# EAGLE design otto 1284 K (EAGLE 6.1)
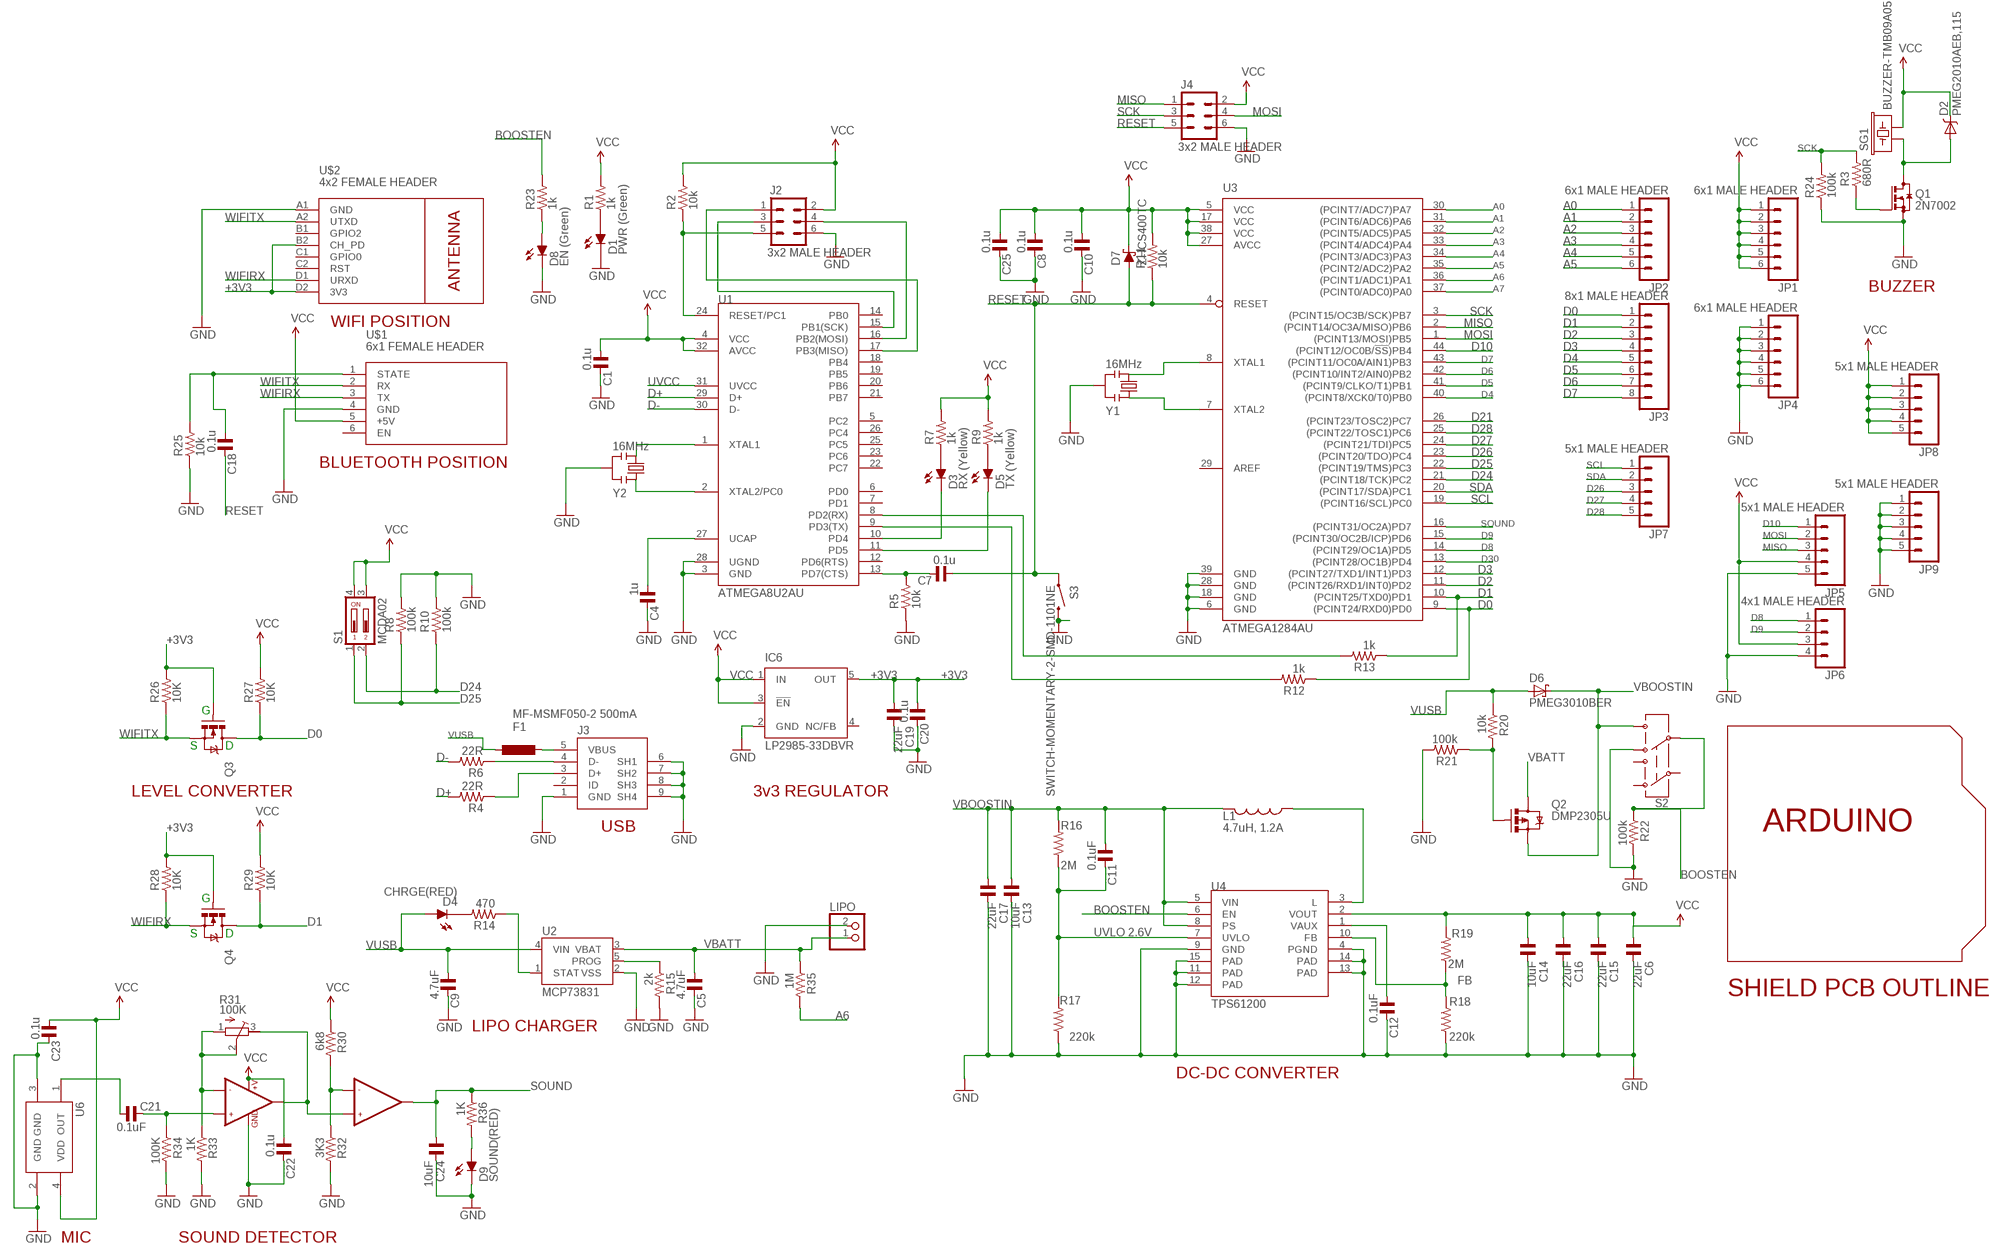
[diagram p0: schematic, sheet 1]

## Parts
C1  0.1u  C_0805MP  [C0805MP]
C4  1u  C_0805MP  [C0805MP]
C5  4.7uF  C_0603MP  [C0603MP]
C6  22uF  C_0805MP  [C0805MP]
C7  0.1u  C_0805MP  [C0805MP]
C8  0.1u  C_0805MP  [C0805MP]
C9  4.7uF  C_0603MP  [C0603MP]
C10  0.1u  C_0805MP  [C0805MP]
C11  0.1uF  C_0603MP  [C0603MP]
C12  0.1uF  C_0603MP  [C0603MP]
C13  10uF  C_1206MP  [C1206MP]
C14  10uF  C_1206MP  [C1206MP]
C15  22uF  C_0805MP  [C0805MP]
C16  22uF  C_0805MP  [C0805MP]
C17  22uF  C_0805MP  [C0805MP]
C18  0.1u  C_0805MP  [C0805MP]
C19  22uF  C_0805MP  [C0805MP]
C20  0.1u  C_0805MP  [C0805MP]
C21  0.1uF  C_0603MP  [C0603MP]
C22  0.1u  C_0603MP  [C0603MP]
C23  0.1u  C_0603MP  [C0603MP]
C24  10uF  C_1206MP  [C1206MP]
C25  0.1u  C_0603MP  [C0603MP]
D1  PWR (Green)  LEDCHIP-LED0805MP  [CHIP-LED0805MP]
D2  PMEG2010AEB,115  DIODE-SCHOTTKY  [SOD-523]
D3  RX (Yellow)  LEDCHIP-LED0805MP  [CHIP-LED0805MP]
D4  CHRGE(RED)  LEDCHIP-LED0805MP  [CHIP-LED0805MP]
D5  TX (Yellow)  LEDCHIP-LED0805MP  [CHIP-LED0805MP]
D6  PMEG3010BER  [SOD123W]
D7  ZHCS400TC  SCHOTTKY-DIODESOD323  [SOD323]
D8  EN (Green)  LEDCHIP-LED0805MP  [CHIP-LED0805MP]
D9  SOUND(RED)  LEDCHIP-LED0805MP  [CHIP-LED0805MP]
F1  MF-MSMF050-2 500mA  0002_MF-MSMF050-2  [L1812]
IC6  LP2985-33DBVR  TPS77033  [SOT23-DBV]
J2  3x2 MALE HEADER  M03X2-LOCK  [2X03_LOCK]
J3  0219_14850  [USB-MINI-B_2]
J4  3x2 MALE HEADER  M03X2-LOCK  [2X03_LOCK]
JP1  6x1 MALE HEADER  M06SIP  [1X06]
JP2  6x1 MALE HEADER  M06SIP  [1X06]
JP3  8x1 MALE HEADER  M081X08  [1X08]
JP4  6x1 MALE HEADER  M06SIP  [1X06]
JP5  5x1 MALE HEADER  M05PTH  [1X05]
JP6  4x1 MALE HEADER  M04PTH  [1X04]
JP7  5x1 MALE HEADER  M05PTH  [1X05]
JP8  5x1 MALE HEADER  M05PTH  [1X05]
JP9  5x1 MALE HEADER  M05PTH  [1X05]
L1  4.7uH, 1.2A  INDUCTOR-CDRH4D16FB  [INDUCTOR-CDRH4D16FB]
LIPO  JST_2PIN-THM  [JST-PH-2-THM]
Q1  2N7002  BSS123  [SOT23]
Q2  DMP2305U  MOSFET-PCHANNELSMD  [SOT23-3]
Q3  2N7002  MOSFET-NCHANNELBSS123LT1G  [SOT23]
Q4  2N7002  MOSFET-NCHANNELBSS123LT1G  [SOT23]
R1  1k  R_0805MP  [R0805MP]
R2  10k  R_0805MP  [R0805MP]
R3  680R  R_0805MP  [R0805MP]
R4  22R  R_0805MP  [R0805MP]
R5  10k  R_0805MP  [R0805MP]
R6  22R  R_0805MP  [R0805MP]
R7  1k  R_0805MP  [R0805MP]
R8  100k  R_0805MP  [R0805MP]
R9  1k  R_0805MP  [R0805MP]
R10  100k  R_0805MP  [R0805MP]
R11  10k  R_0805MP  [R0805MP]
R12  1k  R_0805MP  [R0805MP]
R13  1k  R_0805MP  [R0805MP]
R14  470  R_0603MP  [R0603MP]
R15  2k  R_0603MP  [R0603MP]
R16  2M  R_0603MP  [R0603MP]
R17  220k  R_0603MP  [R0603MP]
R18  220k  R_0603MP  [R0603MP]
R19  2M  R_0603MP  [R0603MP]
R20  10k  R_0805MP  [R0805MP]
R21  100k  R_0805MP  [R0805MP]
R22  100k  R_0603MP  [R0603MP]
R23  1k  R_0805MP  [R0805MP]
R24  100k  R_0805MP  [R0805MP]
R25  10k  R_0805MP  [R0805MP]
R26  10K  R_0603MP  [R0603MP]
R27  10K  R_0603MP  [R0603MP]
R28  10K  R_0603MP  [R0603MP]
R29  10K  R_0603MP  [R0603MP]
R30  6k8  R_0603MP  [R0603MP]
R31  100K  R-TRIMM4G/J  [RTRIM4G/J]
R32  3K3  R_0603MP  [R0603MP]
R33  1K  R_0603MP  [R0603MP]
R34  100K  R_0603MP  [R0603MP]
R35  1M  R_0603MP  [R0603MP]
R36  1K  R_0603MP  [R0603MP]
S1  MCDA02  DA02  [DA-02]
S2  SWITCH-DPDTEG2211  [EG2211]
S3  SWITCH-MOMENTARY-2-SMD-1101NE  [TACTILE-SWITCH-1101NE]
SG1  BUZZER-TMB09A05  BUZZER-CPE-171  [BUZZER_9MM_PTH]
U1  ATMEGA8U2AU  [TQFP32-08]
U2  MCP73831  [SOT23-5]
U3  ATMEGA1284AU  ATMEGA1284P-AU  [TQFP44]
U4  TPS61200  [QFN-10_PAD]
U5  LMV358  [SO08]
U6  SPW2430_MIC  [SPW2430_SILICON_MIC]
U$1  6x1 FEMALE HEADER  WIRELESS-BLUETOOTH-HC-05-PLAIN  [WIRELESS-BLUETOOTH-HC-05-PLAIN]
U$2  4x2 FEMALE HEADER  WIRELESS-WIFI-ESP-01-PLAIN  [WIRELESS-WIFI-ESP-01-PLAIN]
U$47  SHIELDSMALL  [ARDUINOSHIELDSMALL]
Y1  16MHz  0011_CSTCE16M0V53-R0  [RESONATOR]
Y2  16MHz  0011_CSTCE16M0V53-R0  [RESONATOR]

## Nets
+3V3: C19.1 C20.1 IC6.5(OUT) Q3.1(G) Q4.1(G) R26.2 R28.2 U$2.B2(CH_PD) U$2.D2(3V3)
A0: JP2.1 U3.30((PCINT7/ADC7)PA7)
A1: JP2.2 U3.31((PCINT6/ADC6)PA6)
A2: JP2.3 U3.32((PCINT5/ADC5)PA5)
A3: JP2.4 U3.33((PCINT4/ADC4)PA4)
A4: JP2.5 U3.34((PCINT3/ADC3)PA3)
A5: JP2.6 U3.35((PCINT2/ADC2)PA2)
A6: R35.2 U3.36((PCINT1/ADC1)PA1)
A7: U3.37((PCINT0/ADC0)PA0)
BOOSTEN: R22.1 R23.2 S2.P2 U4.6(EN)
D0: JP3.1 Q3.3(D) R12.1 R27.1 U3.9((PCINT24/RXD0)PD0)
D1: JP3.2 Q4.3(D) R13.1 R29.1 U3.10((PCINT25/TXD0)PD1)
D2: JP3.3 U3.11((PCINT26/RXD1/INT0)PD2)
D3: JP3.4 U3.12((PCINT27/TXD1/INT1)PD3)
D4: JP3.5 U3.40((PCINT8/XCK0/T0)PB0)
D5: JP3.6 U3.41((PCINT9/CLKO/T1)PB1)
D6: JP3.7 U3.42((PCINT10/INT2/AIN0)PB2)
D7: JP3.8 U3.43((PCINT11/OC0A/AIN1)PB3)
D8: JP6.1 U3.14((PCINT29/OC1A)PD5)
D9: JP6.2 U3.15((PCINT30/OC2B/ICP)PD6)
D10: JP5.1 U3.44((PCINT12/OC0B/!SS!)PB4)
D21: U3.26((PCINT23/TOSC2)PC7)
D24: R10.1 S1.2 U3.21((PCINT18/TCK)PC2)
D25: R8.1 S1.1 U3.22((PCINT19/TMS)PC3)
D26: JP7.3 U3.23((PCINT20/TDO)PC4)
D27: JP7.4 U3.24((PCINT21/TDI)PC5)
D28: JP7.5 U3.25((PCINT22/TOSC1)PC6)
D30: U3.13((PCINT28/OC1B)PD4)
D+: R4.2 U1.29(D+)
D-: R6.2 U1.30(D-)
FB: R18.2 R19.1 U4.10(FB)
GND: C1.2 C4.2 C5.2 C6.2 C8.2 C9.2 C10.2 C12.2 C13.2 C14.2 C15.2 C16.2 C17.2 C19.2 C20.2 C22.2 C23.2 C24.2 C25.2 D1.C D8.C D9.C IC6.2(GND) J2.6 J3.1(GND) J3.6(SH1) J3.7(SH2) J3.8(SH3) J3.9(SH4) J4.6 JP4.1 JP4.2 JP4.3 JP4.4 JP4.5 JP4.6 JP5.5 JP6.4 JP9.1 JP9.2 JP9.3 JP9.4 JP9.5 LIPO.2 Q1.2(S) R5.1 R8.2 R10.2 R15.2 R17.1 R18.1 R21.2 R22.2 R24.1 R25.1 R32.2 R33.2 R34.2 S2.P2-TA S3.P$2 U1.3(GND) U1.28(UGND) U2.2(VSS) U3.6(GND) U3.18(GND) U3.28(GND) U3.39(GND) U4.4(PGND) U4.9(GND) U4.11(PAD) U4.12(PAD) U4.13(PAD) U4.14(PAD) U4.15(PAD) U5.4(GND) U6.2(GND) U6.3(GND) U$1.4(GND) U$2.A1(GND) Y1.2 Y2.2
MISO: J4.1 JP5.3 U3.2((PCINT14/OC3A/MISO)PB6)
MOSI: J4.4 JP5.2 U3.1((PCINT13/MOSI)PB5)
N$1: U3.8(XTAL1) Y1.3
N$2: U3.7(XTAL2) Y1.1
N$3: R15.1 U2.5(PROG)
N$4: D2.A Q1.3(D) SG1.P$1
N$5: Q1.1(G) R3.1
N$6: R12.2 U1.9(PD3(TX))
N$7: R13.2 U1.8(PD2(RX))
N$8: U1.1(XTAL1) Y2.3
N$9: U1.2(XTAL2/PC0) Y2.1
N$10: C4.1 U1.27(UCAP)
N$11: J3.3(D+) R4.1
N$12: J3.4(D-) R6.1
N$13: J2.1 U1.17(PB3(MISO))
N$14: J2.3 U1.15(PB1(SCK))
N$15: J2.5 R2.1 U1.24(RESET/PC1)
N$16: J2.4 U1.16(PB2(MOSI))
N$17: F1.2 J3.5(VBUS)
N$18: R14.1 U2.1(STAT)
N$19: D4.C R14.2
N$20: L1.P$1 U4.3(L)
N$21: C12.1 U4.1(VAUX)
N$22: D8.A R23.1
N$23: C18.1 R25.2 U$1.1(STATE)
N$24: Q2.1(G) R20.2 R21.1
N$25: R31.1(A) R31.2(S) R33.1 U5.2(-IN1)
N$26: D3.A R7.1
N$27: D5.A R9.1
N$28: R31.3(E) U5.1(OUT1) U5.5(+IN2)
N$29: D3.C U1.10(PD4)
N$30: D5.C U1.11(PD5)
N$31: C7.2 R5.2 U1.13(PD7(CTS))
N$32: R30.2 R32.1 U5.6(-IN2)
N$33: C21.2 R34.1 U5.3(+IN1)
N$34: D1.A R1.1
N$35: C21.1 U6.1(OUT)
N$37: D9.A R36.2
RESET: C7.1 C18.2 D7.A J4.5 R11.1 S3.P$1 U3.4(RESET)
SCK: J4.3 R3.2 R24.2 U3.3((PCINT15/OC3B/SCK)PB7)
SCL: JP7.1 U3.19((PCINT16/SCL)PC0)
SDA: JP7.2 U3.20((PCINT17/SDA)PC1)
SOUND: C24.1 R36.1 U3.16((PCINT31/OC2A)PD7) U5.7(OUT2)
UVCC: U1.31(UVCC)
UVLO: C11.2 R16.1 R17.2 U4.7(UVLO)
VBATT: C5.1 LIPO.1 Q2.3(D) R35.1 U2.3(VBAT)
VBOOSTIN: C11.1 C13.1 C17.1 D6.1(K) L1.P$2 Q2.2(S) R16.2 S2.P2-TB U4.5(VIN) U4.8(PS)
VCC: C1.1 C6.1 C8.1 C10.1 C14.1 C15.1 C16.1 C22.1 C23.1 C25.1 D2.C D7.C IC6.1(IN) IC6.3(!EN) J2.2 J4.2 JP1.1 JP1.2 JP1.3 JP1.4 JP1.5 JP1.6 JP5.4 JP6.3 JP8.1 JP8.2 JP8.3 JP8.4 JP8.5 R1.2 R2.2 R7.2 R9.2 R11.2 R19.2 R27.2 R29.2 R30.1 S1.3 S1.4 SG1.P$2 U1.4(VCC) U1.32(AVCC) U3.5(VCC) U3.17(VCC) U3.27(AVCC) U3.38(VCC) U4.2(VOUT) U5.8(+V) U6.4(VDD) U$1.5(+5V)
VUSB: C9.1 D4.A D6.2(A) F1.1 R20.1 U2.4(VIN)
WIFIRX: Q4.2(S) R28.1 U$1.3(TX) U$2.D1(URXD)
WIFITX: Q3.2(S) R26.1 U$1.2(RX) U$2.A2(UTXD)
Unconnected: IC6.4(NC/FB) J3.2(ID) S2.P1 S2.P1-TA S2.P1-TB U1.5(PC2) U1.6(PD0) U1.7(PD1) U1.12(PD6(RTS)) U1.14(PB0) U1.18(PB4) U1.19(PB5) U1.20(PB6) U1.21(PB7) U1.22(PC7) U1.23(PC6) U1.25(PC5) U1.26(PC4) U3.29(AREF) U$1.6(EN) U$2.B1(GPIO2) U$2.C1(GPIO0) U$2.C2(RST)

## Notes on the sheet
- BUZZER
- WIFI POSITION
- BLUETOOTH POSITION
- G
- S | D
- LEVEL CONVERTER | 3v3 REGULATOR
- USB
- G
- S | D | UVLO 2.6V
- SHIELD PCB OUTLINE
- LIPO CHARGER
- DC-DC CONVERTER
- MIC | SOUND DETECTOR

## Library data of the parts
C1 C4-C25 = rc-master-smd:C_: NON-POLARIZED CAP
D1 D3-D5 D8 D9 = led:LED: LED Various Types
D2 = SparkFun-DiscreteSemi:DIODE-SCHOTTKY: Commonly MBRA140.
D6 = nxp_60_1_1:PMEG3010: 30 V, 1A low VF MEGA Schottky barrier rectifier Planar Maximum Efficiency General Application (MEGA) Schottky barrier rectifier with an integrated guard ring for stress protection, encapsulated in a Surface-Mounted Device (SMD) AAL Eindhoven MK
D7 = diode:SCHOTTKY-DIODE: Schottky Diode
F1 = Protezione:0002_MF-MSMF050-2: 500 mA Multifuse � Polyfuse; MONTHLY_USAGE: _____; PART_NUMBER: MF-MSMF050-2; PRICE: _____; SUPPLIER: _____; TYPE: Protezione
IC6 = texas:TPS770*: ULTRALOW-POWER 50-mA LOW-DROPOUT LINEAR REGULATORS 50-mA Low-Dropout Regulator Source: http://focus.ti.com/lit/ds/symlink/tps77001.pdf
J2 J4 = adi-misc:M03X2: This is a 3x2 pin header Note: This part is based on the Sparkfun M04X2 header.
J3 = Connettori:0219_14850: Usb-Mini F 90 Smd; MONTHLY_USAGE: _____; PART_NUMBER: 14850; PRICE: _____; SUPPLIER: _____; TYPE: Connettori; VALUE: USB-mini-90 -SMD
JP1 JP4 = SparkFun-Connectors:M06: Header 6 Standard 6-pin 0.1" header. Use with straight break away headers (SKU : PRT-00116), right angle break away headers (PRT-00553), swiss pins (PRT-00743), machine pins (PRT-00117), and female headers (PRT-00115). Molex polarized connector foot print use with SKU : PRT-08094 with associated ...
JP2 = SparkFun:M06: Header 6 Standard 6-pin 0.1" header. Use with straight break away headers (SKU : PRT-00116), right angle break away headers (PRT-00553), swiss pins (PRT-00743), machine pins (PRT-00117), and female headers (PRT-00115). Molex polarized connector foot print use with SKU : PRT-08094 with associated ...
JP3 = SparkFun:M08: Header 8 Standard 8-pin 0.1" header. Use with straight break away headers (SKU : PRT-00116), right angle break away headers (PRT-00553), swiss pins (PRT-00743), machine pins (PRT-00117), and female headers (PRT-00115).
JP5 JP7-JP9 = SparkFun-Connectors:M05: Header 5 Standard 5-pin 0.1" header. Use with straight break away headers (SKU : PRT-00116), right angle break away headers (PRT-00553), swiss pins (PRT-00743), machine pins (PRT-00117), and female headers (PRT-00115). Molex polarized connector foot print use with SKU : PRT-08230 with associated crimp pins and housings.
JP6 = SparkFun-Connectors:M04: Header 4 Standard 4-pin 0.1" header. Use with straight break away headers (SKU : PRT-00116), right angle break away headers (PRT-00553), swiss pins (PRT-00743), machine pins (PRT-00117), and female headers (PRT-00115). Molex polarized connector foot print use with SKU : PRT-08231 with associated crimp pins and housings. 1MM SMD Version SKU: PRT-10208
L1 = SparkFun-Passives:INDUCTOR-CDRH4D16FB
LIPO = adafruit:JST_2PIN: JST 2-Pin Connectors of various flavors SMT-RA (S2B-PH-SM4) 4UConnector #17311 SMT (B2B-PH-SM4) THM-RA (S2B-PH) THM (B2B-PH)
Q1 = transistor-small-signal:BSS123: N-CHANNEL MOS FET
Q2 = SparkFun-DiscreteSemi:MOSFET-PCHANNEL: Generic PMOSFET
Q3 Q4 = SparkFun-DiscreteSemi:MOSFET-NCHANNEL: Common NMOSFET Parts MFG P/N Store ID Prod ID FDD8780 TRANS-09984 SI7820DN TRANS-11055 FDS6630A IC-08089 2N7002PW TRANS-11151 FQP30N06L COM-10213 TRANS-10060 BSS123LT1G TRANS-08345 BSS138 TRANS-00830 BS170 2N7000; PROD_ID: TRANS-08345
R1-R30 R32-R36 = rc-master-smd:R_: RESISTOR
R31 = rcl:R-TRIMM: Trimm resistor
S1 = switch-dil:DA02: DIL/CODE SWITCH; OC_FARNELL: 1255229; OC_NEWARK: unknown
S2 = SparkFun-Electromechanical:SWITCH-DPDT: DPDT Version of the COM-00597
S3 = SparkFun-Electromechanical:SWITCH-MOMENTARY-2: Various NO switches- pushbuttons, reed, etc
SG1 = bt_buzzer:BUZZER: Buzzer 12mm Spark Fun Electronics SKU : Comp-Buzzer
U1 = SparkFun:ATMEGA8U2: Atmel 8-bit Microcontroller with 8/16/32K Bystes of ISP Flash and USB Controller. ATmega8U2, ATmega16U2, and ATmega32U2
U2 = SparkFun:MCP73831: Microchip's MCP73831 Miniature single cell, fully integrated Li-Ion, Li-polymer charge management controller http://ww1.microchip.com/downloads/en/DeviceDoc/21984a.pdf
U3 = adi-atmega:ATMEGA1284P: 8-bit Microcontroller with 64K Bytes In-System Programmable Flash Source: http://www.atmel.com/dyn/resources/prod_documents/doc2593.pdf; MPN: ATMEGA644PV-10AU; OC_FARNELL: 1455123; OC_NEWARK: 58M3748
U4 = SparkFun:TPS61200: DC to DC Booster
U5 = SparkFun-AnalogIC:LMV358: Jellybean rail-to-rail output op-amp; PROD_ID: IC-09657
U6 = Tristan:SPW2430_MIC: Top Port SiSonic Silicon Microphone with input buffer and output amp Technical Specifications: Supply voltage range: 1.5V to 3.6V Current draw: 70µA @ VDD = 1.8V, 75µA @ VDD = 3.6V Output impedance: 450Ω (@ 1kHz) Datasheet <http://tristanrobitaille.com/spw2430-datasheet> Digi-Key part #: 423-1394-1-ND <http://www.digikey.ca/product-detail/en/knowles/SPW2430HR5H-B/423-1394-1-ND/5052772> Mouser part #: 721-SPW2430HR5HB <http://ca.mouser.com/ProductDetail/Knowles/SPW2430HR5H-B/?qs=%2fha2pyFaduhwHrXlkuR8qD3oDzxHBwOI5SNV724NzP3WuccUjWgX3w%3d%3d> Manufacturer part #: SPW2430HR5H-B; DIGIKEY#: 423-1394-1-ND; MANF: SPW2430HR5H-B SMD Microphone; MANF#: SPW2430HR5H-B; MOUSER#: 721-SPW2430HR5HB
U$1 = diy-modules:WIRELESS-BLUETOOTH-HC-05-PLAIN
U$2 = diy-modules:WIRELESS-WIFI-ESP-01-PLAIN
U$47 = adafruit:SHIELDSMALL
Y1 Y2 = Cristalli:0011_CSTCE16M0V53-R0: 16Mhz - SMD; MONTHLY_USAGE: _____; PART_NUMBER: CSTCE16M0V53-R0; PRICE: _____; SUPPLIER: _____; TYPE: Cristalli; VALUE: CSTCE16M0V53-R0

## Net classes
1 24vPower: width 1.016 mm, clearance 0.762 mm
2 5vPower: width 0.813 mm, clearance 0.762 mm

## Board
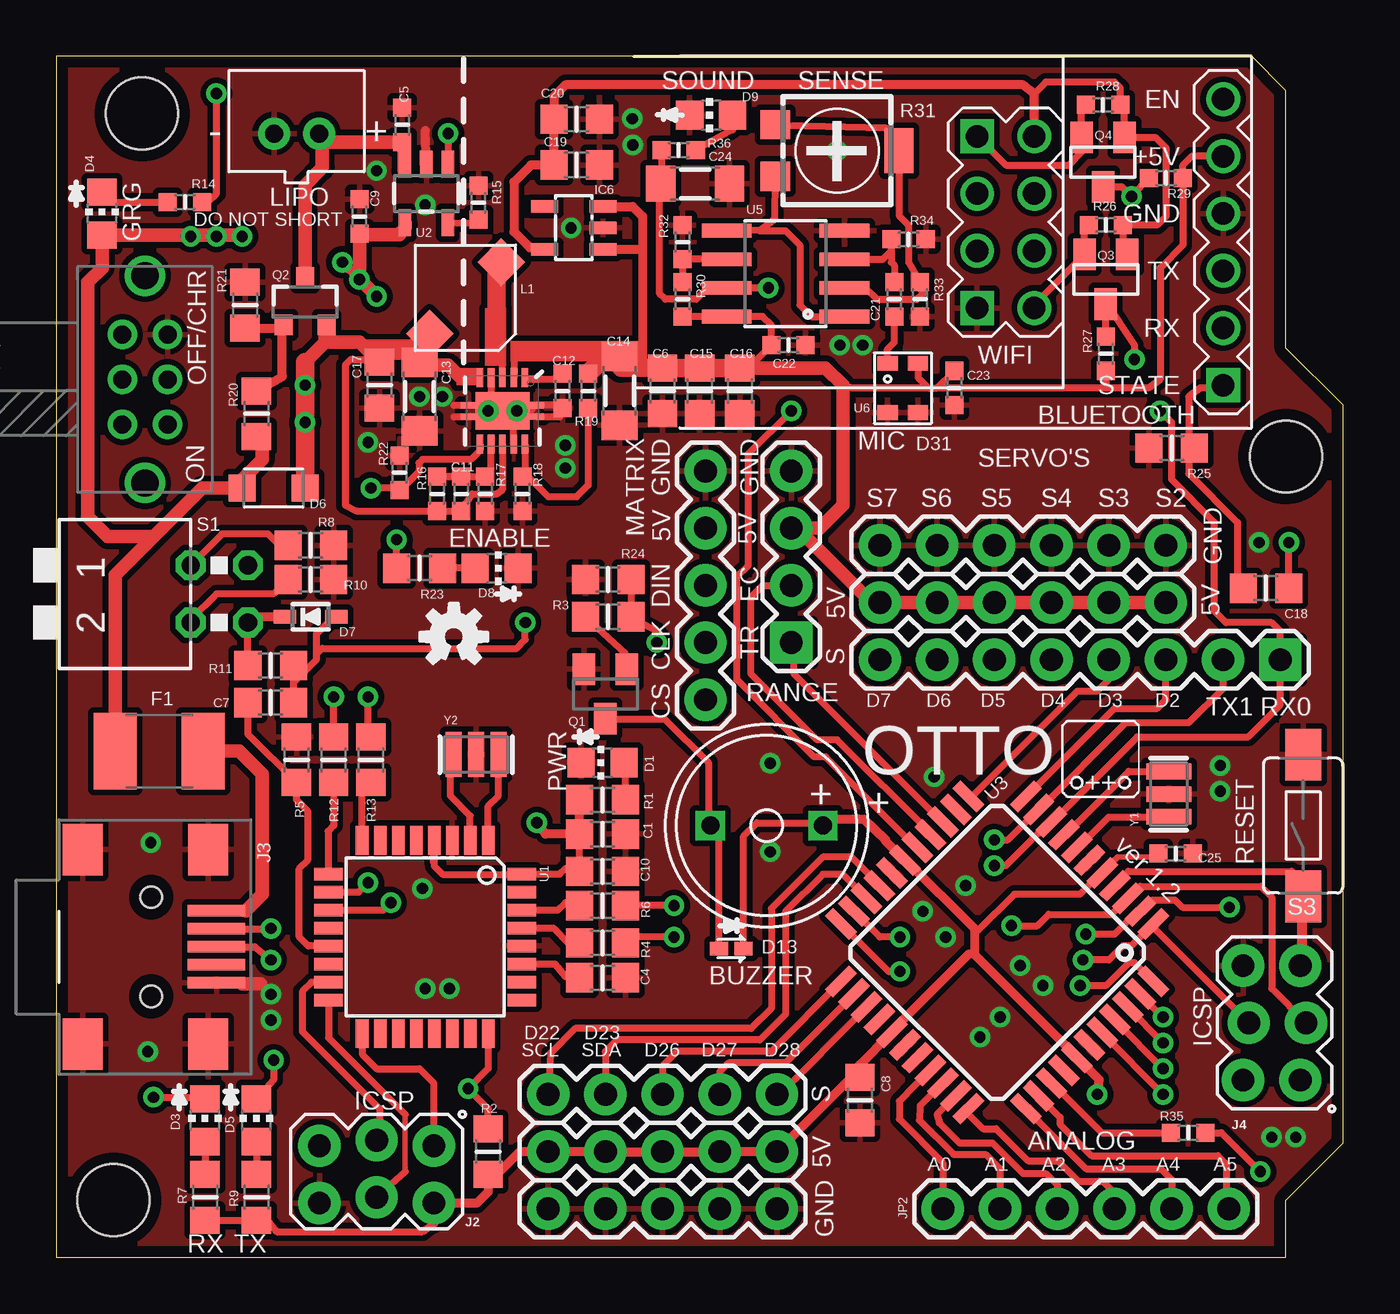
[diagram p1: board, top side]
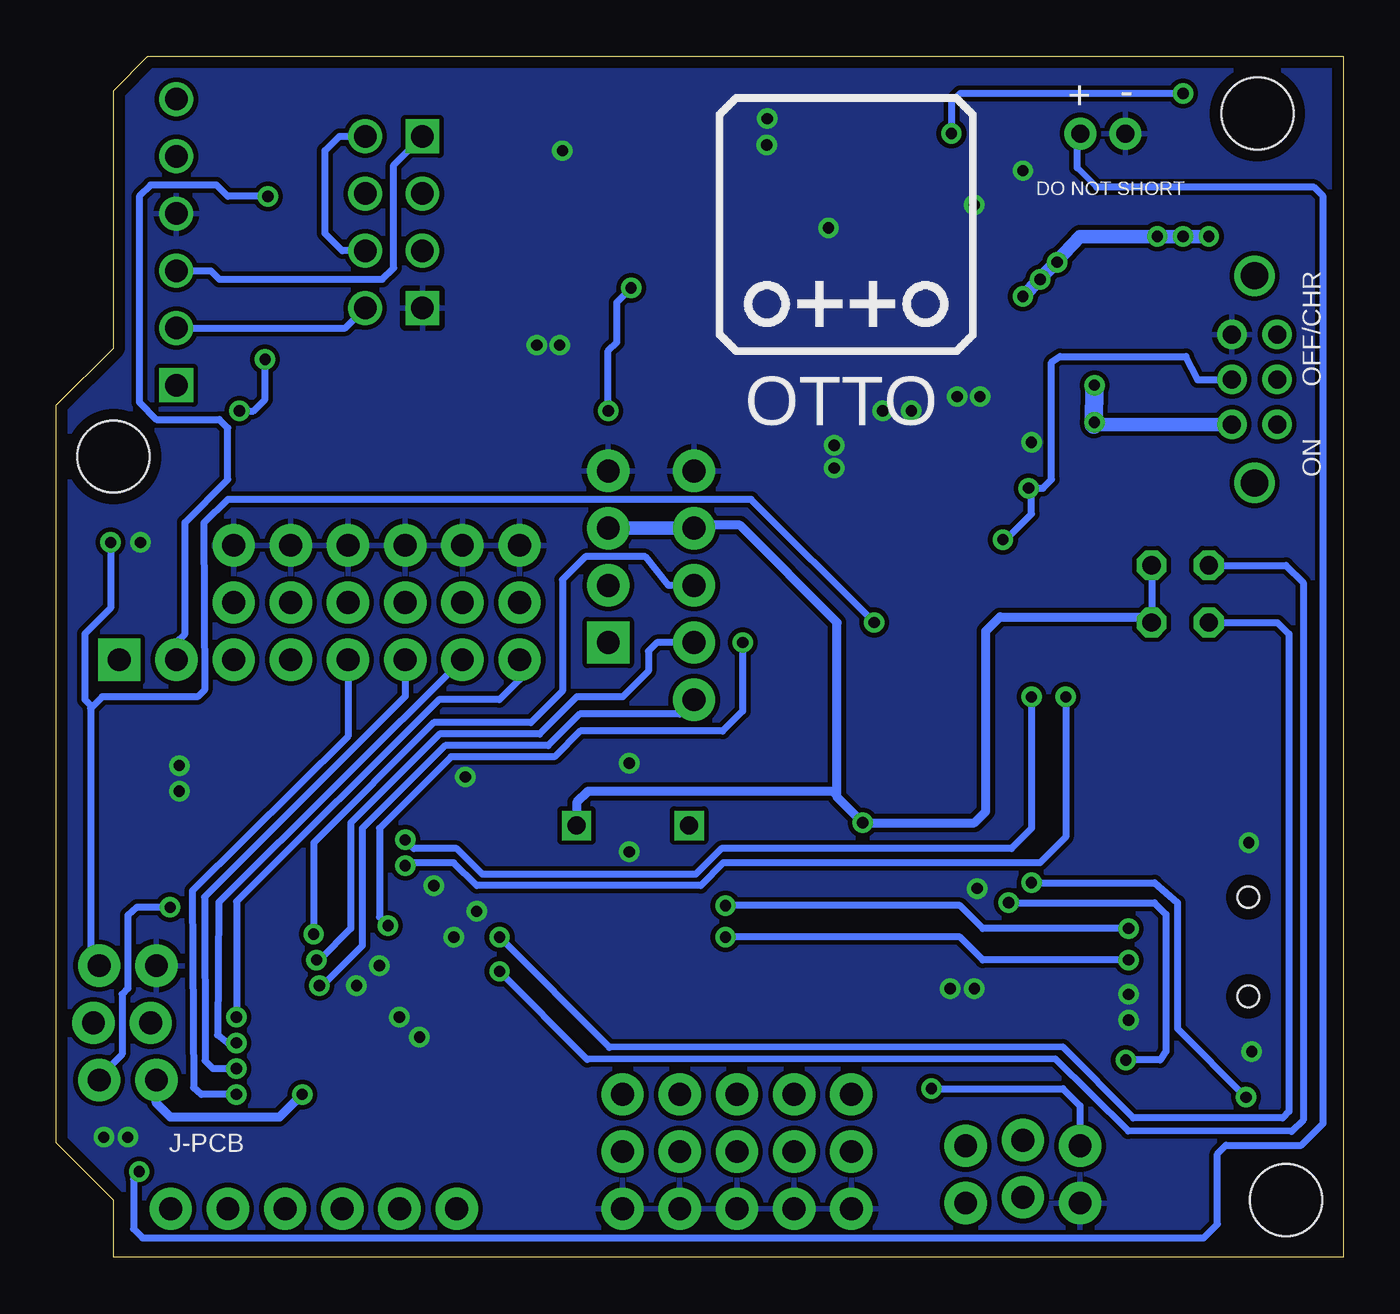
[diagram p2: board, bottom side, seen from below]

Size 57.15 x 53.34 mm. Coordinates in mm from the lower left corner, seen from the top.
Copper layers (1*16): Top 0.035mm / dielectric 1.5mm / Bottom 0.035mm
Design rules: minimum track width 10mil, minimum drill 24mil, track to track 8mil, track to pad 8mil, pad to pad 8mil, via to via 8mil, smd to smd 8mil, copper to edge 20mil, drill to drill 8mil, minimum pad ring 10mil, minimum via ring 8mil, stop-mask expansion 4mil, vias tented up to drill 25mil, thermal gap 10mil

### Footprints (pad centres in the part's own frame; a part is rotated, then mirrored left to right if it is on the bottom)
C0805MP = smd 1.2 x 1.3: 1 -1.016,0; 2 1.016,0
C0603MP = smd 0.8 x 0.8: 1 -0.762,0; 2 0.762,0
C1206MP = smd 1.3 x 1.6: 1 -1.524,0; 2 1.524,0
CHIP-LED0805MP = smd 1.3 x 1.2: A 0,-0.953; C 0,0.953
SOD-523 = smd 0.8 x 0.6: A -0.55,0; C 0.55,0
SOD123W = smd 1.2 x 1.2: 1 -1.4,0; 2 1.4,0
SOD323 = smd 1 x 0.6: A 1.143,0; C -1.143,0
L1812 = smd 1.9 x 3.4: 1 -1.95,0; 2 1.95,0
SOT23-DBV = smd 0.55 x 1.2: 1 -0.95,-1.3; 2 0,-1.3; 3 0.95,-1.3; 4 0.95,1.3; 5 -0.95,1.3
2X03_LOCK = drill 1.016 pad 1.88: 1 -2.54,-1.143; 2 -2.54,1.397; 3 0,-1.397; 4 0,1.143; 5 2.54,-1.143; 6 2.54,1.397
USB-MINI-B_2 = smd 0.508 x 2.54: 1 0,0; 2 0.8,0; 3 1.6,0; 4 2.4,0; 5 3.2,0 | smd 2.286 x 1.778: 6 -2.717,5.948; 7 -2.717,0.36; 8 5.918,0.36; 9 5.918,5.948 | hole 0.95: -0.6,2.9; 3.8,2.9
1X06 = drill 1.016 pad 1.88: 1 0,0; 2 2.54,0; 3 5.08,0; 4 7.62,0; 5 10.16,0; 6 12.7,0
1X08 = drill 1.016 pad 1.88 square: 1 0,0 | drill 1.016 pad 1.88: 2 2.54,0; 3 5.08,0; 4 7.62,0; 5 10.16,0; 6 12.7,0; 7 15.24,0; 8 17.78,0
1X05 = drill 1.016 pad 1.88: 1 0,0; 2 2.54,0; 3 5.08,0; 4 7.62,0; 5 10.16,0
1X04 = drill 1.016 pad 1.88 square: 1 0,0 | drill 1.016 pad 1.88: 2 2.54,0; 3 5.08,0; 4 7.62,0
INDUCTOR-CDRH4D16FB = smd 1.5 x 1.5 rotated 135: P$1 -1.905,1.905 | smd 1.5 x 1.5 rotated 315: P$2 1.27,5.08
JST-PH-2-THM = drill 0.8 pad 1.422: 1 1,0; 2 -1,0
SOT23 = smd 1 x 1.4: 1 -0.95,-1.1; 2 0.95,-1.1; 3 0,1.1
SOT23-3 = smd 0.8 x 0.9: 1 -0.95,-1; 2 0.95,-1; 3 0,1.1
R0805MP = smd 1.2 x 1.3: 1 -1.016,0; 2 1.016,0
R0603MP = smd 0.8 x 0.8: 1 -0.762,0; 2 0.762,0
RTRIM4G/J = smd 1.3 x 1.3: 1 -1.15,-2.75; 3 1.15,-2.75 | smd 2 x 1.3: 2 0,2.75
DA-02 = drill 0.813 octagon: 1 -1.27,-1.27; 2 1.27,-1.27; 3 1.27,1.27; 4 -1.27,1.27
EG2211 = drill 0.8: P1 -1,0; P1-TA -1,2; P1-TB -1,-2; P2 1,0; P2-TA 1,2; P2-TB 1,-2 | drill 1.2: P$7 0,4.6; P$8 0,-4.6
TACTILE-SWITCH-1101NE = smd 2.3 x 1.6: P$1 -3.15,0; P$2 3.15,0
BUZZER_9MM_PTH = drill 0.8 square: P$1 0,2.5; P$2 0,-2.5
TQFP32-08 = smd 1.27 x 0.559: 1 -4.293,2.8; 2 -4.293,2; 3 -4.293,1.2; 4 -4.293,0.4; 5 -4.293,-0.4; 6 -4.293,-1.2; 7 -4.293,-2; 8 -4.293,-2.8; 17 4.293,-2.8; 18 4.293,-2; 19 4.293,-1.2; 20 4.293,-0.4; 21 4.293,0.4; 22 4.293,1.2; 23 4.293,2; 24 4.293,2.8 | smd 0.559 x 1.27: 9 -2.8,-4.293; 10 -2,-4.293; 11 -1.2,-4.293; 12 -0.4,-4.293; 13 0.4,-4.293; 14 1.2,-4.293; 15 2,-4.293; 16 2.8,-4.293; 25 2.8,4.293; 26 2,4.293; 27 1.2,4.293; 28 0.4,4.293; 29 -0.4,4.293; 30 -1.2,4.293; 31 -2,4.293; 32 -2.8,4.293
SOT23-5 = smd 0.55 x 1.2: 1 -0.95,-1.3; 2 0,-1.3; 3 0.95,-1.3; 4 0.95,1.3; 5 -0.95,1.3
TQFP44 = smd 1.5 x 0.5: 1 -5.8,4; 2 -5.8,3.2; 3 -5.8,2.4; 4 -5.8,1.6; 5 -5.8,0.8; 6 -5.8,0; 7 -5.8,-0.8; 8 -5.8,-1.6; 9 -5.8,-2.4; 10 -5.8,-3.2; 11 -5.8,-4; 23 5.8,-4; 24 5.8,-3.2; 25 5.8,-2.4; 26 5.8,-1.6; 27 5.8,-0.8; 28 5.8,0; 29 5.8,0.8; 30 5.8,1.6; 31 5.8,2.4; 32 5.8,3.2; 33 5.8,4 | smd 0.5 x 1.5: 12 -4,-5.8; 13 -3.2,-5.8; 14 -2.4,-5.8; 15 -1.6,-5.8; 16 -0.8,-5.8; 17 0,-5.8; 18 0.8,-5.8; 19 1.6,-5.8; 20 2.4,-5.8; 21 3.2,-5.8; 22 4,-5.8; 34 4,5.8; 35 3.2,5.8; 36 2.4,5.8; 37 1.6,5.8; 38 0.8,5.8; 39 0,5.8; 40 -0.8,5.8; 41 -1.6,5.8; 42 -2.4,5.8; 43 -3.2,5.8; 44 -4,5.8
QFN-10_PAD = smd 0.297 x 0.85: 1 -1,-1.475; 2 -0.5,-1.475; 3 0,-1.475; 4 0.5,-1.475; 5 1,-1.475; 6 1,1.475; 7 0.5,1.475; 8 0,1.475; 9 -0.5,1.475; 10 -1,1.475 | smd 0.7 x 0.28: 11 -1.5,0.25; 12 -1.5,-0.25; 13 1.5,0.25; 14 1.5,-0.25 | smd 2.4 x 1.65: 15 0,0
SO08 = smd 0.61 x 2.21: 1 -1.905,-2.616; 2 -0.635,-2.616; 3 0.635,-2.616; 4 1.905,-2.616; 5 1.905,2.616; 6 0.635,2.616; 7 -0.635,2.616; 8 -1.905,2.616
SPW2430_SILICON_MIC = smd 0.9 x 0.66: 1 -0.675,1.095; 2 -0.675,-1.095; 3 0.675,-1.095; 4 0.675,1.095
WIRELESS-BLUETOOTH-HC-05-PLAIN = drill 1 square: 1 -6.35,-17.145 | drill 1: 2 -3.81,-17.145; 3 -1.27,-17.145; 4 1.27,-17.145; 5 3.81,-17.145; 6 6.35,-17.145
WIRELESS-WIFI-ESP-01-PLAIN = drill 1 square: A1 -7.62,3.81; D1 -7.62,-3.81 | drill 1: A2 -10.16,3.81; B1 -7.62,1.27; B2 -10.16,1.27; C1 -7.62,-1.27; C2 -10.16,-1.27; D2 -10.16,-3.81
ARDUINOSHIELDSMALL = hole 3.2: -13.97,33.02; 36.83,17.78; -15.24,-15.24
RESONATOR = smd 0.7 x 2: 1 -1,0; 2 0,0; 3 1,0

### Placement (x,y rotation side)
C1  24.26,18.8 0 top
C4  24.26,12.42 0 top
C5  15.37,50.29 90 top
C6  26.92,38.48 270 top
C7  9.52,24.64 180 top
C8  35.69,6.99 270 top
C9  13.46,46.23 90 top
C10  24.26,17.15 0 top
C11  17.98,33.91 90 top
C12  22.48,38.48 270 top
C13  16.13,38.23 270 top
C14  25.02,38.48 270 top
C15  28.57,38.48 270 top
C16  30.35,38.48 270 top
C17  14.35,38.74 270 top
C18  53.72,29.72 0 top
C19  23.11,48.51 0 top
C20  23.11,50.55 0 top
C21  37.21,42.55 90 top
C22  32.51,40.51 0 top
C23  39.88,38.61 270 top
C24  28.37,47.68 0 top
C25  49.71,17.93 0 top
D1  24.26,21.97 90 top
D2  29.97,13.72 0 top
D3  6.6,6.1 0 top
D4  2.03,46.35 0 top
D5  8.89,6.1 0 top
D6  9.65,34.16 180 top
D7  11.3,28.45 0 top
D8  19.56,30.61 270 top
D9  29.08,50.72 90 top
F1  4.57,22.48 0 top
IC6  22.99,45.72 90 top
J2  14.22,3.81 180 top
J3  7.11,12.19 90 top
J4  54.1,10.41 90 top
JP1  36.58,29.08 0 top
JP2  39.37,2.16 0 top
JP3  54.36,26.54 180 top
JP4  36.58,31.62 0 top
JP5  28.83,24.77 90 top
JP6  32.64,27.3 90 top
JP7  21.84,7.24 0 top
JP8  21.84,4.7 0 top
JP9  21.84,2.16 0 top
L1  17.86,46.1 180 top
LIPO  10.67,49.91 0 top
LOGO2  OSHW-LOGOS  [OSHW-LOGO-S]  17.65,27.56 0 top
Q1  24.38,25.02 180 top
Q2  11.05,42.42 0 top
Q3  46.61,43.43 180 top
Q4  46.48,48.64 180 top
R1  24.26,20.32 180 top
R2  19.18,4.7 270 top
R3  24.51,28.45 0 top
R4  24.26,13.97 180 top
R5  10.67,22.1 270 top
R6  24.26,15.62 180 top
R7  6.6,2.67 270 top
R8  11.3,31.62 0 top
R9  8.89,2.67 270 top
R10  11.3,30.1 0 top
R11  9.52,26.29 180 top
R12  12.32,22.1 270 top
R13  13.97,22.1 270 top
R14  5.71,46.86 180 top
R15  18.75,46.84 90 top
R16  16.92,33.91 270 top
R17  19.05,33.91 90 top
R18  20.7,33.91 90 top
R19  23.62,38.48 90 top
R20  8.89,37.46 90 top
R21  8.38,42.29 90 top
R22  15.24,34.85 90 top
R23  16.13,30.61 180 top
R24  24.51,30.1 0 top
R25  49.53,35.94 0 top
R26  46.61,45.85 0 top
R27  46.61,40.13 270 top
R28  46.48,51.18 0 top
R29  49.28,47.93 0 top
R30  27.81,42.55 90 top
R31  34.67,49.15 270 top
R32  27.81,45.09 90 top
R33  38.35,42.55 270 top
R34  37.85,45.21 0 top
R35  50.27,5.54 180 top
R36  27.64,49.17 0 top
S1  7.24,29.46 270 top
S2  3.94,38.99 0 top
S3  55.37,19.18 90 top
SG1  31.55,19.18 90 top
U1  16.38,14.22 270 top
U2  16.43,47.24 180 top
U3  41.78,13.54 225 top
U4  19.81,37.59 180 top
U5  32.38,43.69 90 top
U6  37.59,38.61 0 top
U$1  34.67,45.09 90 top
U$2  33.27,45.97 180 top
U$47  17.78,17.78 0 top
Y1  49.4,20.57 90 top
Y2  18.64,22.33 0 top

### Tracks (layer width: path | path; a pad name or v marks a point on that pad's centre or on a via)
+3V3
  Top 0.305: 43.43,51.69 43.94,52.2 46.99,52.2 47.24,51.94 R28.2 47.43,50.99 Q4.1 48.81,49.74 49.28,49.28 49.28,46.23 48.89,45.85 R26.2 | 47.43,45.91 R26.2 | R26.2 47.37,44.72 Q3.1
  Top 0.406: IC6.5 21.75,44.7 21.84,44.7 21.72,44.83 21.03,44.83 20.32,45.54 20.32,47.75 21.08,48.51 C19.1 C20.1 22.1,51.56 22.61,52.07 42.93,52.07 43.43,51.69 U$2.D2
  Bottom 0.305: U$2.B2 44.45,44.7 45.21,45.47 45.21,49.15 44.58,49.78 U$2.D2
A0
  Top 0.305: U3.30 38.78,8.3 37.44,6.93 37.44,6.15 39.37,4.19 JP2.1
A1
  Top 0.305: U3.31 39.36,7.74 38.35,6.73 38.33,6.1 39.85,4.57 41.27,4.57 41.91,3.94 JP2.2
A2
  Top 0.305: U3.32 39.12,6.35 39.22,5.97 40.11,5.08 41.58,5.08 42.93,3.73 43.94,3.73 44.45,3.23 JP2.3 44.45,2.13
A3
  Top 0.305: U3.33 40.51,6.35 41.15,5.72 41.73,5.72 43.16,4.29 44.48,4.29 45.39,3.38 46.48,3.38 46.97,2.9 46.97,2.18 JP2.4
A4
  Top 0.305: U3.34 45.72,3.94 49.05,3.94 49.53,3.45 JP2.5
A5
  Top 0.305: U3.35 44.58,6.22 44.58,5.92 45.97,4.52 51.59,4.52 51.97,4.14 51.97,2.34 52.07,2.24 JP2.6
A6
  Top 0.305: U3.36 44.23,7.74 46.43,5.54 R35.2 49.55,5.54
BOOSTEN  (via drill 0.5)
  Top 0.305: U4.6 18.81,35.83 18.41,35.43 16.26,35.43 16.1,35.28 16.1,34.9 15.44,34.24 15.42,34.24 | v13.97,34.16 14.94,34.16 15.01,34.09 R22.1 15.27,34.09 15.42,34.24 | R23.2 v15.11,31.88 | 15.42,34.24 15.37,34.24 | 15.37,34.24 15.34,34.24 15.29,34.19 15.32,34.19 15.37,34.24
  Bottom 0.305: S2.P2 4.95,38.99 4.97,38.97 6.46,38.97 6.98,40.01 12.57,40.01 12.95,39.75 12.95,34.54 13.33,34.16 v13.97,34.16 14.1,34.16 13.84,33.91 13.84,33.02 14.99,31.88 v15.11,31.88
D0  (via drill 0.5)
  Top 0.305: U3.9 44.23,19.34 | 44.23,19.34 44.32,19.43 | 44.32,19.43 48.01,23.11 52.93,23.11 54.36,24.54 JP3.1 54.36,27.81 53.97,28.19 51.94,28.19 51.44,28.7 51.44,32.64 49.53,34.54 49.53,37.08 v49.02,37.59 | R12.1 v12.32,24.89 | v41.66,17.4 42.16,17.4 43.56,18.8 43.81,18.92 | 44.23,19.34 43.81,18.92 | 43.81,18.92 43.81,19.05 44.2,19.43 44.32,19.43 | R27.1 Q3.3 46.61,42.42 47.88,40.51 v47.88,39.88
  Bottom 0.305: v12.32,24.89 12.32,18.67 13.46,17.53 27.53,17.53 28.52,16.51 38.48,16.51 39.5,17.53 41.27,17.53 v41.66,17.4 | v49.02,37.59 48.39,37.59 47.88,38.1 47.88,39.75 47.82,39.81 | 47.82,39.81 47.75,39.88 | v47.88,39.88 47.82,39.81
D1  (via drill 0.5)
  Top 0.305: JP3.2 51.82,25.27 50.29,23.75 47.5,23.75 43.65,19.9 U3.10 42.26,18.54 v41.66,18.54 | R13.1 13.97,23.37 13.84,23.5 v13.84,24.89 | 46.36,47.5 46.4,47.54 Q4.3 47.33,47.54 v47.75,47.12 R29.1
  Bottom 0.305: v13.84,24.89 13.84,19.05 14.73,18.16 27.61,18.16 28.75,17.02 38.23,17.02 39.37,18.16 41.27,18.16 v41.66,18.54 | JP3.2 51.82,27.3 51.44,27.69 51.44,32.64 49.53,34.54 49.53,36.83 49.91,37.21 52.7,37.21 53.47,37.97 53.47,47.12 52.96,47.63 50.04,47.63 49.53,47.12 v47.75,47.12
D2
  Top 0.305: U3.11 43.07,20.47 46.99,24.38 48.89,24.38 49.28,24.77 JP3.3
D3
  Top 0.305: U3.12 40.66,20.47 45.34,25.15 46.23,25.15 46.74,25.65 JP3.4
D4  (via drill 0.5)
  Top 0.305: U3.40 46.45,9.94 v49.15,7.24
  Bottom 0.305: JP3.5 44.2,23.14 51.11,16.28 51.05,7.54 50.7,7.24 v49.15,7.24
D5  (via drill 0.5)
  Top 0.305: 46.96,10.57 U3.41 47.02,10.52 v49.15,8.38
  Bottom 0.305: JP3.6 41.66,24.92 50.57,16 50.55,8.74 50.19,8.38 v49.15,8.38
D6  (via drill 0.5)
  Top 0.305: U3.42 47.58,11.09 v49.15,9.53
  Bottom 0.305: JP3.7 49.94,15.77 49.99,9.88 49.53,9.53 v49.15,9.53
D7  (via drill 0.5)
  Top 0.305: 48.12,11.7 U3.43 48.15,11.67 v49.15,10.67
  Bottom 0.305: JP3.8 36.58,25.65 37.46,24.77 40.16,24.77 49.15,15.8 v49.15,10.67 49.28,10.54
D8
  Top 0.305: U3.14 39.34,19.34 32.77,25.91 32.77,27.18 JP6.1
D9
  Top 0.305: U3.15 38.81,18.85 34.67,22.99 33.78,22.99 30.86,25.91 30.86,29.34 31.37,29.85 JP6.2
D10  (via drill 0.5)
  Top 0.305: U3.44 48.7,12.26 47.88,13.08 47.62,13.08 46.61,12.07 v45.47,12.07
  Bottom 0.305: JP5.1 29.46,24.13 33.91,24.13 35.31,22.73 39.88,22.73 43.56,19.05 43.56,13.84 45.34,12.07 | 45.47,11.94 45.34,12.07 | v45.47,12.07 45.34,12.07
D24  (via drill 0.5)
  Top 0.305: v37.46,14.22 36.57,14.22 U3.21 | R10.1 9.65,29.46 7.11,29.46 5.97,28.32 S1.2 5.97,28.07
  Bottom 0.305: S1.2 2.92,28.19 2.41,27.69 2.41,6.48 2.69,6.2 9.32,6.2 12.45,9.35 32.59,9.32 v37.46,14.22
D25  (via drill 0.5)
  Top 0.305: v37.46,12.7 36.96,12.7 35.56,14.1 U3.22 | R8.1 10.16,31.37 9.4,32.13 7.37,32.13 S1.1
  Bottom 0.305: S1.1 2.54,30.73 1.78,29.97 1.78,6.1 2.29,5.59 9.55,5.61 12.78,8.81 33.58,8.79 v37.46,12.7
D26
  Top 0.305: U3.23 34.85,12.25 31.75,9.14 27.56,9.14 26.92,8.51 JP7.3
D27
  Top 0.305: U3.24 35.42,11.67 32.38,8.64 29.84,8.64 29.46,8.26 JP7.4
D28
  Top 0.305: U3.25 35.98,11.09 32,7.11 | 32,7.11 31.88,6.99 31.88,7.24 32,7.37 | JP7.5 32,7.11
D+
  Top 0.305: U1.29 22.08,14.62 22.73,13.97 R4.2
D-
  Top 0.305: U1.30 22.28,15.42 22.61,15.75 R6.2
FB
  Top 0.305: R19.1 23.62,34.29 23.11,33.78 21.84,33.78 20.95,34.67 R18.2 20.72,34.66 20.81,34.66 | U4.10 20.81,34.66 | 20.81,34.66 20.7,34.54
GND  (via drill 0.5, 0.5 pad 0.25)
  Top 0.305: U1.3 17.58,18.74 17.53,18.8 | U4.4 19.31,37.73 v19.18,37.59 18.93,37.34 U4.13 | U4.9 20.31,37.46 v20.45,37.59 | v20.45,37.59 21.06,37.59 U4.12 | C12.2 22.31,37.63 22.61,37.85 20.7,37.85 v20.45,37.59 | 22.35,37.34 21.59,37.34 U4.11 | 17.65,37.34 U4.13 | 17.65,37.85 18.54,37.85 18.54,37.84 U4.14 | 18.41,37.34 U4.13
  Top 0.406: U2.2 16.38,50.04 | 9.07,12.14 v9.52,11.68
  Top 0.61: 8.25,12.14 9.07,12.14
  other vias: 42.8,12.95 53.97,5.33 38.99,21.34 16.38,11.94 41.91,10.67 40.39,16.51 38.48,15.37 41.02,9.78 39.5,14.22 43.81,12.07 31.7,18.01 31.7,21.95 51.69,21.84 51.69,20.7 16.26,16.38 9.52,10.54 13.84,36.2 16.13,38.23 22.61,36.07 22.61,35.05 17.14,38.23 16.38,46.74 14.22,48.26 22.86,45.72 53.42,31.75 34.8,40.51 35.81,40.51 34.67,49.15 4.19,18.42 4.06,9.14 25.58,50.57 17.45,11.94 55.04,5.33 25.6,49.4
  pour Top (isolate 0.254): -1.65,54.36 59.82,54.36 59.82,-1.27 -1.65,-1.27
  pour Bottom: -0.76,54.23 59.44,54.23 59.44,-1.65 -0.76,-1.65
MISO  (via drill 0.5)
  Top 0.305: v52.09,15.55 50.01,15.55 49.68,15.88 48.67,15.88 U3.2 48.01,15.38 46.99,14.35 v45.72,14.35
  Bottom 0.305: v52.09,15.55 53.57,15.55 53.97,15.19 53.97,11.94 54.23,11.68 54.23,9.02 55.37,7.87 J4.1 | JP5.3 29.97,29.85 30.99,31.12 33.66,31.12 34.67,30.1 34.67,25.15 36.07,23.75 40.39,23.75 45.72,18.42 v45.72,14.35
MOSI  (via drill 0.5)
  Top 0.305: U3.1 48.71,14.66 | 48.71,14.66 J4.4 | 48.71,14.66 48.57,14.66 47.75,13.84 47.37,13.84 46.74,13.21 v45.59,13.21
  Bottom 0.305: JP5.2 30.48,27.3 30.86,26.92 30.86,26.04 32,24.89 34.04,24.89 35.69,23.24 40.13,23.24 44.07,19.3 44.07,14.61 45.47,13.21 v45.59,13.21
N$1
  Top 0.305: U3.8 44.8,18.77 47.62,21.59 49.42,21.59 | 49.53,21.59 49.42,21.59 | 49.42,21.59 Y1.3
N$2
  Top 0.305: U3.7 45.38,18.2 46.74,19.56 49.39,19.56 Y1.1
N$3
  Top 0.305: U2.5 18.68,45.92 R15.1
N$4
  Top 0.305: Q1.3 27.01,23.92 28.96,21.97 28.96,19.56 | 28.96,19.56 28.96,19.43 | 28.96,19.43 28.96,19.3 | 28.96,19.56 29,19.52 SG1.P$1 29,19.39 | D2.A 29.42,18.97 29,19.39 | 29,19.39 28.96,19.43
N$5
  Top 0.305: R3.1 25.27,26.82 Q1.1
N$6
  Top 0.305: R12.2 12.32,19.18 12.06,18.92 12.06,17.05 U1.9
N$7
  Top 0.305: U1.8 13.58,19.55 13.59,20.19 13.59,21.21 R13.2
N$8
  Top 0.305: U1.1 19.18,20.05 19.63,20.5 19.63,21.87 | 19.63,21.87 19.61,21.9 | 19.61,21.9 19.61,21.74 19.69,21.67 | 19.64,21.88 19.63,21.87 | 19.61,21.9 19.61,22.25 19.66,22.3 Y2.3
N$9
  Top 0.305: U1.2 18.38,19.62 17.5,20.5 17.5,22.18 Y2.1
N$10
  Top 0.305: U1.27 22.16,13.02 22.61,12.47 C4.1
N$11  (via drill 0.5)
  Top 0.305: J3.3 8.81,13.79 v9.52,13.21 | v27.43,14.22 25.78,14.22 25.65,14.1 R4.1
  Bottom 0.305: v9.52,13.21 16,13.21 17.02,14.22 v27.43,14.22
N$12  (via drill 0.5)
  Top 0.305: J3.4 9.51,14.59 v9.52,14.61 | v27.43,15.62 R6.1
  Bottom 0.305: v9.52,14.61 16,14.61 17.02,15.62 v27.43,15.62
N$13
  Top 0.305: U1.17 13.58,9.02 14.22,8.38 16.13,8.38 16.76,7.75 J2.1
N$14
  Top 0.305: U1.15 11.33,12.22 10.92,11.81 10.92,10.03 14.35,6.6 14.35,4.95 J2.3
N$15  (via drill 0.5)
  Top 0.305: U1.24 19.18,8.39 v18.29,7.49 19.18,6.6 R2.1
  Bottom 0.305: v18.29,7.49 12.45,7.49 11.68,6.73 J2.5
N$16
  Top 0.254: 15.49,6.35 15.49,3.81
  Top 0.305: U1.16 12.09,9.75 15.49,6.35 | 15.49,3.81 J2.4
N$17
  Top 0.406: J3.5 8.41,15.39 | 6.6,22.48 7.11,22.48 7.24,22.35 6.65,22.35 F1.2
  Top 0.61: 8.41,15.39 9.14,16.13 9.14,21.46 8.13,22.48 7.11,22.48
N$18  (via drill 0.5)
  Top 0.305: R14.1 6.73,46.86 7.11,47.24 v7.11,51.69 | v17.4,49.91 17.4,48.23 U2.1
  Bottom 0.305: v7.11,51.69 17.02,51.69 17.4,51.31 v17.4,49.91
N$19
  Top 0.305: D4.C 2.48,47.31 2.54,46.86 R14.2
N$20
  Top 0.305: U4.3 19.81,40.11 19.56,40.26
  Top 0.61: 19.56,43.66 19.76,43.76 L1.P$1
  Top 0.813: 19.56,40.26 19.56,43.66
N$21
  Top 0.305: C12.1 22.44,39.33 22.1,38.99 20.89,38.99 U4.1
N$22
  Top 0.305: D8.A R23.1 17.02,30.61
N$23
  Top 0.305: U$1.1 51.82,38.61 50.8,38.61 50.29,38.23 50.29,35.94 | 53.09,29.59 C18.1 52.45,30.23 52.45,32.64 50.29,34.8 50.29,35.94 | R25.2 50.29,35.94
N$24
  Top 0.406: R21.1 9.96,41.27 Q2.1 10.03,41.35 10.03,39.12 R20.2
N$25
  Top 0.305: R31.1 31.49,50.3 36.83,50.16 R31.2 37.42,46.27 37.85,45.85 37.85,44.2 R33.1 | U5.2 35.94,43.05 36.45,42.55 38.23,42.55 38.48,42.8 R33.1 | R33.1 38.48,43.43
N$26
  Top 0.305: D3.A R7.1
N$27
  Top 0.305: D5.A R9.1
N$28
  Top 0.305: R31.3 31.88,46.09 31.24,45.59 | 31.24,45.59 29.59,45.64 U5.5 | 35.18,41.78 35.05,41.78 U5.1 33.53,41.78 33.02,42.29 33.02,44.96 32.38,45.59 31.24,45.59
N$29  (via drill 0.5)
  Top 0.305: U1.10 13.43,16.22 v13.84,16.64 | v4.32,7.11 6.54,7.11 D3.C
  Bottom 0.305: v13.84,16.64 8.38,16.64 7.37,15.75 7.37,10.16 v4.32,7.11
N$30  (via drill 0.5)
  Top 0.305: U1.11 14.53,15.42 v14.86,15.75 | v9.65,8.76 9.65,7.87 8.95,7.11 D5.C
  Bottom 0.305: v14.86,15.75 8.38,15.75 7.87,15.24 7.87,9.14 8.13,8.76 v9.65,8.76
N$31
  Top 0.305: U1.13 11.2,13.82 10.79,14.22 10.79,17.27 11.18,17.65 11.18,19.81 10.67,20.32 R5.2 8.51,23.24 C7.2
N$32
  Top 0.305: U5.6 R32.1 R30.2
N$33
  Top 0.305: 37.08,44.7 37.08,44.2 37.21,44.07 C21.2 | U5.3 36.7,44.32 37.08,44.7 | 37.08,44.7 R34.1
N$34
  Top 0.305: R1.1 25.27,22.42 D1.A
N$35
  Top 0.305: U6.1 36.92,40.35 37.21,40.64 C21.1
N$37
  Top 0.305: D9.A 30.04,50.08 R36.2
RESET  (via drill 0.5)
  Top 0.305: U3.4 47.02,16.54 47.6,17.15 54.86,17.15 55.27,16.87 J4.5 55.37,13.08 S3.P$1 55.27,16.89 | R11.1 C7.1 10.54,25.53 11.56,26.54 11.56,26.8 | 11.56,26.8 11.81,27.05 20.45,27.05 20.83,27.43 v20.83,28.19 | 11.56,26.8 11.56,27.69 12.32,28.45 D7.A | C18.2 v54.74,31.75
  Bottom 0.305: v20.83,28.19 26.29,33.66 49.53,33.66 50.6,32.61 50.57,25.2 50.88,24.89 55.12,24.89 55.63,24.38 | 55.63,24.38 55.63,13.34 J4.5 | v54.74,31.75 54.74,28.83 55.88,27.69 55.88,24.77 55.63,24.51 55.63,24.38
SCK  (via drill 0.5)
  Top 0.305: U3.3 47.58,15.96 | 47.58,15.96 48.13,16.49 53.49,16.49 53.97,16 53.97,11.94 J4.3 | v26.67,27.3 26.67,27.81 R3.2 R24.2 | v42.42,14.73 43.56,14.73 44.07,15.24 46.86,15.24 47.58,15.96
  Bottom 0.305: v26.67,27.3 26.67,24.26 27.56,23.37 33.88,23.37 35.03,22.23 39.62,22.23 42.8,19.05 42.8,15.11 v42.42,14.73
SCL
  Top 0.305: U3.19 36.55,16.54 35.31,17.78 34.04,17.78 31.75,15.49 31.75,11.05 30.86,10.16 23.04,10.16 21.95,9.07 JP7.1
SDA
  Top 0.305: U3.20 35.98,15.96 34.92,17.02 34.04,17.02 32.38,15.37 32.38,10.8 31.24,9.65 24.89,9.65 24.38,9.14 JP7.2
SOUND  (via drill 0.5)
  Top 0.305: U3.16 38.19,18.2 34.16,22.23 33.66,22.23 30.23,25.65 30.23,30.23 30.73,30.73 30.73,35.69 v32.64,37.59 | v31.62,43.05 U5.7 28.91,43.03 28.42,42.55 27.05,42.55 26.8,42.8 26.8,47.8 26.82,47.83 26.82,47.7 C24.1 26.87,47.7 R36.1
  Bottom 0.305: v32.64,37.59 32.64,40.26 32.26,40.64 32.26,42.42 v31.62,43.05
UVLO
  Top 0.305: R16.1 C11.2 | C11.2 17.27,34.67 | C11.2 R17.2 18.92,34.67 19.3,35.05 19.3,36.11 U4.7
VBATT  (via drill 0.5)
  Top 0.305: 15.44,48.25 U2.3 | 12.03,49.52 LIPO.1 | R35.1 51.74,5.54 v53.47,3.81
  Top 0.406: 11.81,49.91 LIPO.1
  Top 0.61: 15.44,48.25 15.44,49.51 C5.1 12.03,49.52 | Q2.3 11.05,47.63 11.81,48.39 11.81,49.91
  Bottom 0.254: 10.95,47.52 11.81,48.39
  Bottom 0.305: v53.47,3.81 53.47,3.73 53.72,3.48 53.72,1.27 53.31,0.86 6.2,0.86 5.59,1.47 5.59,4.6 5.21,4.98 1.85,4.98 0.89,5.94 0.89,47.12 1.29,47.52 10.95,47.52 | 11.81,48.39 11.81,49.77 LIPO.1
VBOOSTIN  (via drill 0.5)
  Top 0.305: v11.05,38.74 11.05,39.62 11.05,39.63 11.05,39.75 | U4.8 19.81,34.09 19.58,33.91 18.47,33.91 C11.1 R16.2 13.33,33.15 12.83,33.4 12.83,39.62 13.08,39.88 14.22,39.88 14.48,40.13 14.48,40.26 C17.1 | 16.13,39.62 C13.1 15.62,40.26 | U4.5 17.96,39.07 17.65,39.37
  Top 0.406: 11.94,41.36 Q2.2
  Top 0.61: 11.05,39.75 11.94,40.64 | 11.94,40.64 11.94,41.36 | 17.96,39.07 17.4,39.62 16.13,39.62 | L1.P$2 16.2,40.94 16.13,40.87 | 11.94,40.64 13.46,40.64 14.22,39.88
  Top 0.813: D6.1 11.05,39.75 | 16.13,40.87 C13.1 | 14.48,40.26 15.62,40.26
  Bottom 0.305: 11.08,36.99 11.08,37.05 v11.05,37.08
  Bottom 0.61: S2.P2-TB 11.08,36.99
  Bottom 0.813: 11.08,36.99 v11.05,38.74
VCC  (via drill 0.5)
  Top 0.254: 46.48,17.1 46.48,17.12 47.14,17.78 48.82,17.78 48.84,17.8 | 49,17.98 49,17.96 48.84,17.8 | 48.84,17.8 48.89,17.8 49,17.91 48.97,17.91 C25.1
  Top 0.305: JP6.3 32.77,32.39 | 36.45,28.83 JP1.1 | 45.32,8.91 U3.38 45.39,8.81 | U3.5 46.48,17.1 46.48,17.15 45.47,16.13 42.55,16.13 40.89,14.48 40.77,14.61 | 37.12,10.07 U3.27 37.05,9.93 | 40.51,13.46 40.77,13.46 | U3.17 37.73,17.64 | JP8.2 24.51,4.57 24.64,4.7 | 16.76,17.53 16.76,18.5 U1.4 16.78,17.38 17.14,17.02 U1.32 | R7.2 R9.2 9.27,1.78 9.78,1.14 16.26,1.14 16.76,1.52 | C10.1 23.11,17.27 22.61,17.27 22.36,17.02 U1.32 | 23.37,17.27 C10.1 | 16.76,2.54 J2.2 16.64,2.41 | C10.1 C1.1 | 19.18,3.56 R2.2 19.05,3.56 19.05,3.43 19.18,3.3 19.18,3.56 | D2.C 30.52,18.71 31.12,19.3 33.91,19.3 SG1.P$2 34.04,19.3 | 36.83,18.49 36.83,18.54 | 8.51,26.16 R11.2 S1.3 8.76,28.45 | U1.32 20.7,17.02 | C8.1 35.31,8 | 19.3,3.43 19.18,3.56 | 21.08,40.26 20.32,40.39 U4.2 | 24.38,40.01 24.89,40.01 C14.1 25.07,39.93 25.07,39.51 | U$1.5 50.42,48.9 50.04,48.51 R29.2 50.04,44.96 49.02,43.94 49.02,38.99 48.51,38.61 46.61,38.61 | 46.61,38.61 39.12,38.61 | 38.73,38.61 35.31,38.61 34.92,38.74 | R27.2 46.61,38.61 | R30.1 U5.8 31.37,41.78 31.75,41.4 C22.1 30.73,39.5 C16.1 | U6.4 38.27,39.08 38.73,38.61 | 38.73,38.61 39.12,38.61 | 39.12,38.61 C23.1 | 26.03,39.5 C6.1
  Top 0.406: JP6.3 33.02,32.26 | 45.32,8.91 40.77,13.46 40.77,14.61 37.73,17.64 | 37.12,10.07 40.51,13.46 | 37.05,9.93 35.69,8.56 C8.1 | 45.39,8.81 46.3,7.9 v46.23,7.24 | 16.76,1.52 J2.2 18.67,2.41 19.18,2.92 19.18,3.3 | 36.83,18.49 U3.17 | 36.83,18.54 35.87,19.46 34.47,19.46 33.91,19.3 | R1.2 C1.1 21.72,18.8 v21.34,19.3 | D7.C 8.76,28.45 | 35.31,8 JP8.5 JP8.4 JP8.3 24.64,4.7 JP8.1 20.57,4.7 19.3,3.43 | IC6.3 25.59,46.67 26.03,46.23 26.03,44.7 | 26.03,44.7 26.03,39.5 | IC6.1 25.97,44.77 26.03,44.7
  Top 0.61: JP1.1 JP1.2 JP1.3 JP1.4 JP1.5 JP1.6 | 33.02,32.26 36.45,28.83 | 24.89,40.01 24.26,40.26 | C16.1 34.16,39.5 34.92,38.74 34.92,33.4 33.91,32.39 32.77,32.39
  Top 0.813: 25.07,39.51 C6.1 C15.1 C16.1 | 24.26,40.26 21.08,40.26 | 24.38,40.01 R19.2
  Bottom 0.305: 52.96,7.87 J4.2 | S1.4 S1.3 | 8.51,27.69 S1.3 | 34.04,19.3 SG1.P$2 | 8.76,28.45 S1.3 | 22.48,20.45 22.73,20.7 | 28.96,32.39 28.83,32.51 JP5.4
  Bottom 0.406: v46.23,7.24 47.24,6.22 52.07,6.22 52.7,6.86 J4.2 | 8.76,28.45 15.24,28.45 15.88,27.81 15.88,19.81 16.38,19.3 v21.34,19.3 22.48,20.45 22.48,28.19 26.8,32.51 28.83,32.51 | 22.73,20.7 33.53,20.7 34.04,20.19 34.04,19.3 | 32.51,32.39 JP6.3
  Bottom 0.61: 28.96,32.39 32.51,32.39
VUSB  (via drill 0.5)
  Top 0.305: 13.86,45.41 C9.1 13.46,45.21 | 7.3,45.4 v5.97,45.34
  Top 0.406: D6.2 8.25,34.54 | 9.14,36.32 9.02,36.45 R20.1 | v12.7,44.2 v13.46,43.43
  Top 0.61: 8.25,34.54 9.14,35.43 9.14,36.32 | F1.1 2.62,30.31 4.32,32 | 4.32,32 6.48,34.16 D6.2 | U2.4 15.48,45.74 15.24,45.41 | 15.21,45.47 15.24,45.41 | 15.24,45.41 13.86,45.41 | v13.46,43.43 13.46,45.21 | 4.32,32 2.29,32 1.4,32.89 1.4,43.31 2.03,43.94 D4.A 7.3,45.4 8.29,45.4 8.31,45.41 8.31,45.39 v8.25,45.34 | v14.22,42.67 14.22,42.7 13.41,43.51
  Bottom 0.61: v5.97,45.34 v7.11,45.34 11.68,45.34 v13.46,43.43 v14.22,42.67
WIFIRX
  Top 0.305: U$2.D1 42.16,48.51 44.96,48.51 45.59,49.15 45.59,49.68 Q4.2 45.53,50.99 R28.1
  Bottom 0.305: U$1.3 50.29,43.82 49.91,43.43 42.67,43.43 42.16,43.94 42.16,48.51 U$2.D1
WIFITX
  Top 0.305: U$2.A2 43.43,42.31 Q3.2 45.66,45.66 R26.1
  Bottom 0.305: U$1.2 44.32,41.27 U$2.A2
(copper drawn outside any net)
  shapes: Top area x5

### Text on the board
tPlace: SOUND | SENSE | GRG | DO NOT SHORT | OFF/CHR | WIFI | BLUETOOTH | MIC | D31 | SERVO'S | ON | GND | GND | S7 | S6 | S5 | S4 | S3 | S2 | MATRIX | ENABLE | 5V | 5V | GND | EC | DIN | 5V | 5V | CLK | TR | S | RANGE | D7 | D6 | D5 | D4 | D3 | D2 | TX1 | RX0 | PWR | CS | OTTO | + | + | RESET | ver 1.2 | D13 | BUZZER | D22 | D23 | ICSP | SCL | SDA | D26 | D27 | D28 | ICSP | S | ANALOG | 5V | A0 | A1 | A2 | A3 | A4 | A5 | RX | TX | GND
bPlace: - | + | DO NOT SHORT | OFF/CHR | OTTO | ON | J-PCB